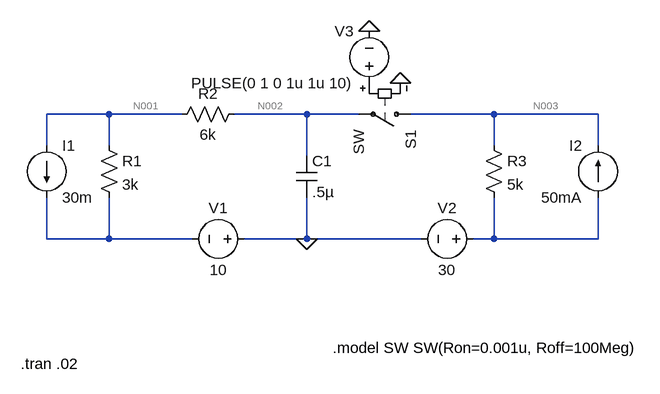
[diagram p0: schematic pas61.asc]
pas61.asc, the LTspice schematic file:
Version 4.1
SHEET 1 996 680
WIRE 144 32 48 32
WIRE 256 32 144 32
WIRE 448 32 336 32
WIRE 528 32 448 32
WIRE 736 32 608 32
WIRE 896 32 736 32
WIRE 48 80 48 32
WIRE 144 80 144 32
WIRE 736 80 736 32
WIRE 896 80 896 32
WIRE 448 96 448 32
WIRE 48 224 48 160
WIRE 144 224 144 160
WIRE 144 224 48 224
WIRE 272 224 144 224
WIRE 448 224 448 160
WIRE 448 224 352 224
WIRE 624 224 448 224
WIRE 736 224 736 160
WIRE 736 224 704 224
WIRE 896 224 896 160
WIRE 896 224 736 224
FLAG 448 224 0
FLAG 544 -96 0
FLAG 592 -16 0
SYMBOL current 48 80 R0
SYMATTR InstName I1
SYMATTR Value 30m
SYMBOL res 128 64 R0
SYMATTR InstName R1
SYMATTR Value 3k
SYMBOL res 352 16 R90
WINDOW 0 0 56 VBottom 2
WINDOW 3 32 56 VTop 2
SYMATTR InstName R2
SYMATTR Value 6k
SYMBOL cap 432 96 R0
SYMATTR InstName C1
SYMATTR Value .5µ
SYMBOL voltage 368 224 R90
WINDOW 0 -32 56 VBottom 2
WINDOW 3 32 56 VTop 2
WINDOW 123 0 0 Left 0
WINDOW 39 0 0 Left 0
SYMATTR InstName V1
SYMATTR Value 10
SYMBOL voltage 720 224 R90
WINDOW 0 -32 56 VBottom 2
WINDOW 3 32 56 VTop 2
WINDOW 123 0 0 Left 0
WINDOW 39 0 0 Left 0
SYMATTR InstName V2
SYMATTR Value 30
SYMBOL current 896 160 R180
WINDOW 0 24 80 Left 2
WINDOW 3 24 0 Left 2
WINDOW 123 0 0 Left 0
WINDOW 39 0 0 Left 0
SYMATTR InstName I2
SYMATTR Value 50mA
SYMBOL res 720 64 R0
SYMATTR InstName R3
SYMATTR Value 5k
SYMBOL sw 624 32 R90
SYMATTR InstName S1
SYMBOL voltage 544 0 R180
WINDOW 0 24 96 Left 2
WINDOW 3 24 16 Left 2
WINDOW 123 0 0 Left 0
WINDOW 39 0 0 Left 0
SYMATTR InstName V3
SYMATTR Value PULSE(0 1 0 1u 1u 10)
TEXT 488 392 Left 2 !.model SW SW(Ron=0.001u, Roff=100Meg)
TEXT 8 416 Left 2 !.tran .02

The netlist it stands for:
* pas61.asc
I1 N001 N004 30m
R1 N001 N004 3k
R2 N002 N001 6k
C1 N002 0 .5µ
V1 0 N004 10
V2 N005 0 30
I2 N005 N003 50mA
R3 N003 N005 5k
S1 N003 N002 P001 0 SW
V3 P001 0 PULSE(0 1 0 1u 1u 10)
.model SW SW(Ron=0.001u, Roff=100Meg)
.tran .02
.backanno
.end

* Results of the author's LTspice run, read from the files saved beside the schematic
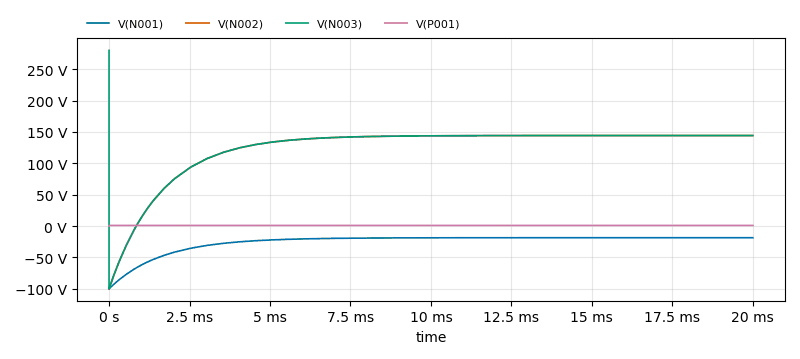
[diagram p1: Transient Analysis of pas61.asc, plotted from the saved traces]
* Transient Analysis, 1 run:
*   V(N001): min -99.99 V, max -18.58 V, average -25.14 V, rms 29.28 V, last -18.58 V
*   V(N002): min -99.97 V, max 144.3 V, average 124.6 V, rms 132.5 V, last 144.3 V
*   V(N003): min -99.97 V, max 280 V, average 124.6 V, rms 132.5 V, last 144.3 V
*   V(P001): min 0 V, max 1 V, average 1 V, rms 1 V, last 1 V